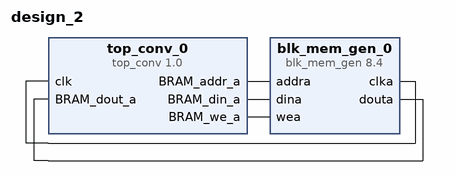
[diagram p0: block diagram of the top level]
# Vivado block design design_2, xck26-sfvc784-2LV-c, Vivado 2022.2
create_bd_design design_2

create_bd_cell -type ip -vlnv xilinx.com:ip:blk_mem_gen:8.4 blk_mem_gen_0
set_property -dict [list \
  CONFIG.Coe_File ../../../../../../init_12.coe \
  CONFIG.Enable_A Always_Enabled \
  CONFIG.Load_Init_File true \
  CONFIG.Write_Depth_A 16 \
  CONFIG.Write_Width_A 384 \
  CONFIG.use_bram_block Stand_Alone \
] [get_bd_cells blk_mem_gen_0]
create_bd_cell -type ip -vlnv caes:user:top_conv:1.0 top_conv_0
set_property -dict {CONFIG.BRAM_BLOCK_WIDTH 4 CONFIG.BRAM_DATA_WIDTH 384 CONFIG.IMAGE_LENGTH 12} [get_bd_cells top_conv_0]

# ---- connections ----

connect_bd_net [get_bd_pins blk_mem_gen_0/clka] [get_bd_pins top_conv_0/clk]
connect_bd_net [get_bd_pins blk_mem_gen_0/douta] [get_bd_pins top_conv_0/BRAM_dout_a]
connect_bd_net [get_bd_pins top_conv_0/BRAM_addr_a] [get_bd_pins blk_mem_gen_0/addra]
connect_bd_net [get_bd_pins top_conv_0/BRAM_din_a] [get_bd_pins blk_mem_gen_0/dina]
connect_bd_net [get_bd_pins top_conv_0/BRAM_we_a] [get_bd_pins blk_mem_gen_0/wea]

validate_bd_design
save_bd_design
